# Altium project SoilMonitor.PrjPcb
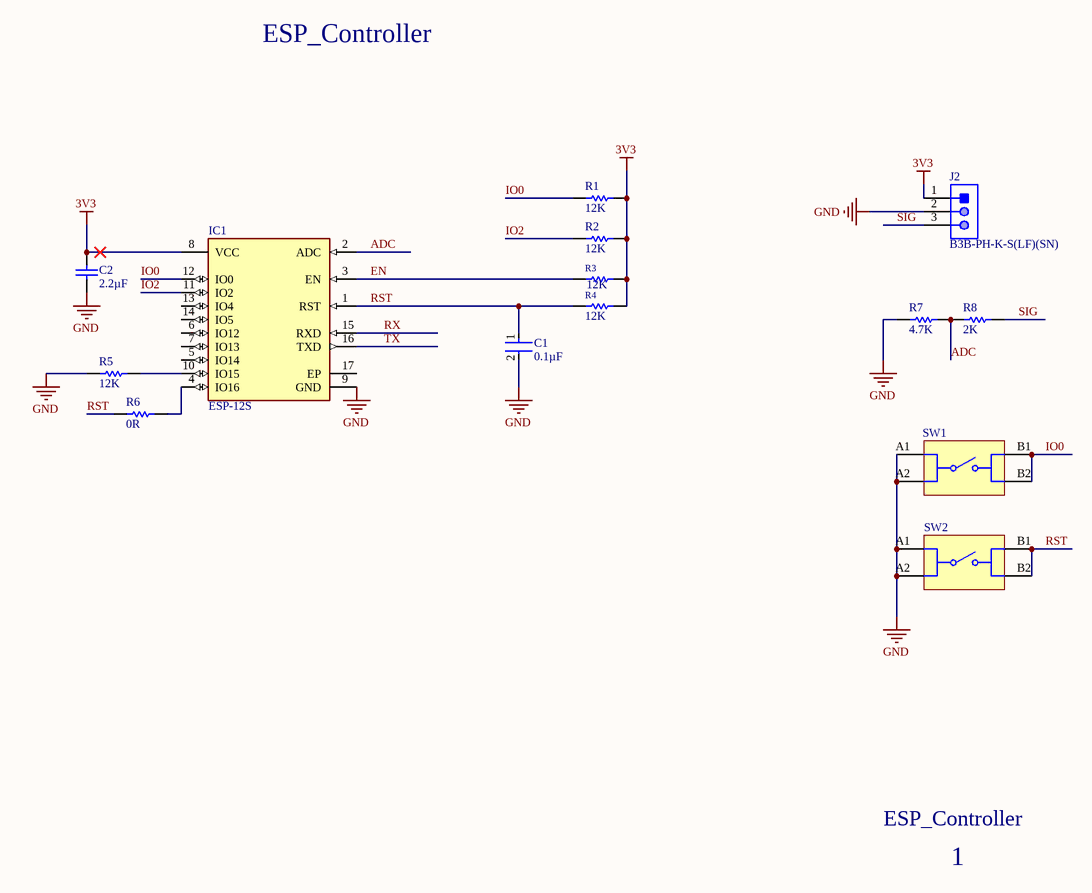
[diagram p0: ESP_Controller.SchDoc]
4 sheets, 38 parts. Net scope: global (net labels, ports and power ports of the same name join across sheets).
Board file: SoilMonitor.PcbDoc
Sheets:
  ESP_Controller.SchDoc
  USB_Input.SchDoc
  USB_to_UART.SchDoc
  Battery_Charging.SchDoc

## Sheet ESP_Controller.SchDoc
size A4; SheetNumber: 1; SheetTotal: 4; SPICEModelCacheITBBTXQH: <root> / <DocumentId>ITBBTXQH</DocumentId> / </root>

### Parts
C1  0.1µF  [FP-CC0603-DA-MFG]
C2  2.2µF  [CAPC2013X145X50ML20T25]
IC1  ESP-12S  [FP-ESP-12S-MFG]
J2  B3B-PH-K-S(LF)(SN)  [JST-B3B-PH-K-S-3_V]
R1  12K  [RESC2013X70X40ML20T20]
R2  12K  [RESC2013X70X40ML20T20]
R3  12K  [RESC2013X70X40ML20T20]
R4  12K  [RESC2013X70X40ML20T20]
R5  12K  [RESC2013X70X40ML20T20]
R6  0R  [RESC2013X70X40NL20T20]
R7  4.7K  [RESC2013X60X40ML20T25]
R8  2K  [RESC2013X60X40ML20T25]
SW1  430773051825  [430773051825]  (value not drawn)
SW2  430773051825  [430773051825]  (value not drawn)

### Nets
3V3: C2.2 IC1.8(VCC) J2.1 R1.2 R2.2 R3.2 R4.2
GND: C1.2 C2.1 IC1.9(GND) J2.2 R5.1 R7.1 SW1.A1 SW1.A2 SW2.A1 SW2.A2
ADC: IC1.2(ADC) R7.2 R8.1
EN: IC1.3(EN) R3.1
IO0: IC1.12(IO0) R1.1 SW1.B1 SW1.B2
IO2: IC1.11(IO2) R2.1
RST: C1.1 IC1.1(RST) R4.1 R6.1 SW2.B1 SW2.B2
RX: IC1.15(RXD)
SIG: J2.3 R8.2
TX: IC1.16(TXD)
NetIC1_4: IC1.4(IO16) R6.2
NetIC1_10: IC1.10(IO15) R5.2

Not connected (* = marked no-connect by the designer): IC1 5(IO14) 6(IO12) 7(IO13) 13(IO4) 14(IO5) 17(EP)

### Notes on the sheet
- ESP_Controller
- 1

### Library data of the parts
C1 = CMP-03422-001463-1: Capacitor Ceramic 0.1uF 6.3V X7R 10% 0603 Paper T/R; RoHS Compliant: Yes
C2 = CMP-1036-04819-2: Part Number: C0805C225K9PACTU; Manufacturer: Kemet
IC1 = CMP-204316-000002-1: RX TXRX MOD WIFI PCB TRACE SMD; Interface: I2C; Sensitivity: -90dBm; Data Rate: 54Mbps; Frequency: 2.484GHz; Series: -
J2 = CMP-2000-05164-1: Male Header, Pitch 2 mm, 1 x 3 Position, Height 6 mm, Tail Length 3.4 mm, -25 to 85 degC, RoHS, Bulk; Manufacturer: JST; Style/Orientation: StraightHeader/Plug; Pitch: 2mm; No of Positions: 3; Termination: Crimp; Manufacturer URL: http://www.jst.com/home2.html; Datasheet Version: Oct-06; Type: ShroudedHeader; Datasheet URL: https://datasheet.ciiva.com/11746/0900766b80826550-11746939.pdf
R1-R5 = CMP-2001-00347-1: Part Number: ERJ-6GEYJ123V; Manufacturer: Panasonic
R6 = CMP-1665-00002-5: Chip Resistor, 0 Ohm, +/- 1%, 0.125 W, -55 to 155 degC, 0805 (2012 Metric), RoHS, Tape and Reel; PartNumber: ERJ-6GEY0R00V; Tolerance: 5%; Resistance: 0 Ohm; REACH SVHC: No SVHC; Min Operating Temperature: -55 degC; Case/Package: 0805; Packaging: Tape and Reel; Package Quantity: 5000; ComponentLink1Description: Manufacturer URL; PackageDescription: 2-Pin Surface Mount Device, Body 2 x 1.25 mm; Mounting Technology: Surface Mount; Max Operating Temperature: 155 degC; Width: 1.25 mm; RoHSCompliant: True; Height: 0.6 mm; ComponentLink1URL: http://www.panasonic.com/; ComponentLink2URL: http://industrial.panasonic.com/cdbs/www-data/pdf/RDA0000/AOA0000C84.pdf; Case Code (Imperial): 0805; DatasheetVersion: 03/2015; Length: 2 mm; Case Code (Metric): 2012; ComponentLink2Description: Datasheet; Radiation Hardening: No
R7 = CMP-2001-00644-1: Part Number: ERA6AEB472V; Manufacturer: Panasonic
R8 = CMP-2001-00609-1: Part Number: ERA6AEB202V; Manufacturer: Panasonic
SW1 SW2 = CMP-03913-86984039-2: Tactile Switch, 0.05A, 12Vdc, 250Gf, Smd Rohs Compliant: Yes; Voltage Rating: 12V; Contact Resistance: 100mΩ; Contact Current Rating: 50mA; Life (Cycles): 500kcycles; Packaging: Tape and Reel; Insulation Resistance: 100MΩ; RoHS: Compliant; Min Operating Temperature: -40°C; Height: 5.1mm; Max Operating Temperature: 85°C; Mount: Surface Mount; Contact Plating: Silver; Current Rating: 50mA; Voltage Rating (DC): 12V

## Sheet USB_Input.SchDoc
size A4; SheetNumber: 2; SheetTotal: 4
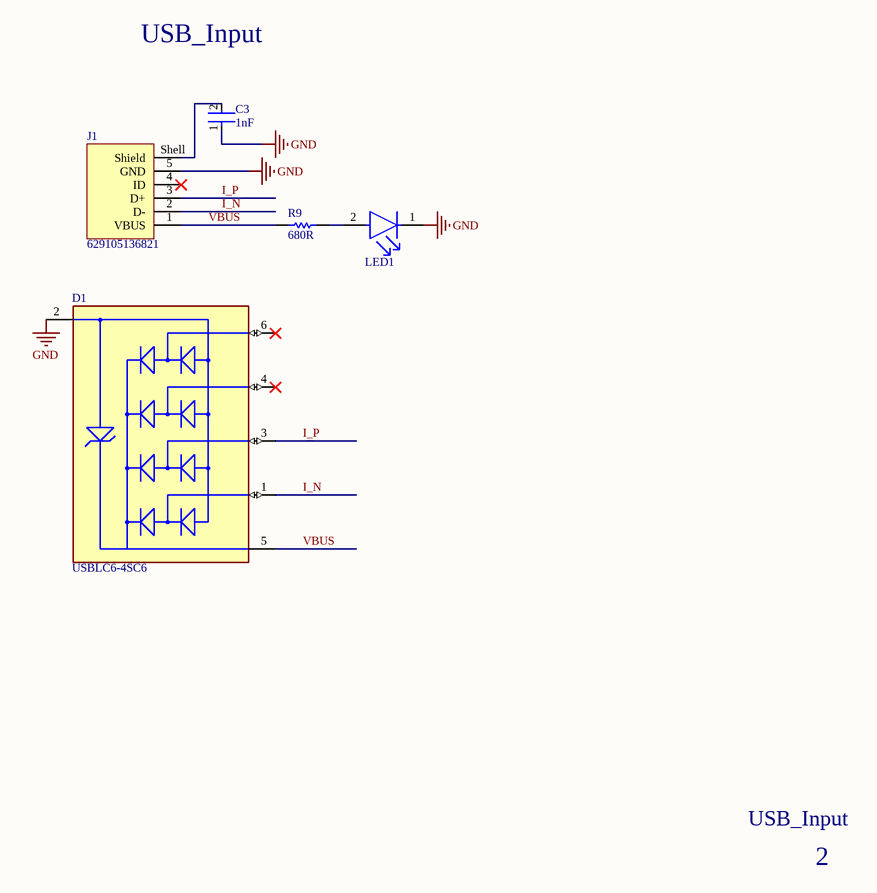
[diagram p1: USB_Input.SchDoc]

### Parts
C3  1nF  [FP-CC0603-DA-MFG]
D1  USBLC6-4SC6  [FP-SOT23-6L-MFG]
J1  629105136821  [629105136821]
LED1  LS R976-NR-1  [FP-LS_R976-MFG]  (value not drawn)
R9  680R  [RESC1608X55X30ML20T20]

### Nets
GND: C3.1 D1.2(GND) J1.5(GND) LED1.1(C)
I_N: D1.1(I/O1) J1.2(D-)
I_P: D1.3(I/O2) J1.3(D+)
VBUS: D1.5(VBUS) J1.1(VBUS) R9.2
NetC3_2: C3.2 J1.Shell(Shield)
NetLED1_2: LED1.2(A) R9.1

Not connected (* = marked no-connect by the designer): D1 4(I/O3)* 6(I/O4)*; J1 4(ID)*

### Notes on the sheet
- USB_Input
- 2

### Library data of the parts
C3 = CMP-2100-03599-2: CAP CER 1000PF 50V X7R 0603; Manufacturer Part Number: CC0603KRX7R9BB102; Manufacturer: YAGEO; Material: Ceramic; Capacitance: 1.0 nF; Tolerance: 0.1; Value: 1.0 nF; Temperature Coefficient: 15%; Device Class L3: Ceramic Capacitors; Automotive: No; Digikey Description: CAP CER 1000PF 50V X7R 0603; Lead Free: Yes; Temperature Range High: +125°C; ComponentLink2URL: http://www.yageo.com/documents/recent/UPY-GPHC_X7R_6.3V-to-50V_18.pdf; Category: Cap; Footprint Url: http://www.yageo.com/exep/pages/download/literatures/UPY-C_GEN_24.pdf; RoHS: TRUE; Octopart: https://octopart.com/cc0603krx7r9bb102-yageo-192933; ComponentLink2Description: Datasheet; Device Class L2: Capacitors; Mouser Description: Multilayer Ceramic Capacitors MLCC - SMD/SMT 1.0nF 50V X7R 10%; Temperature Range Low: -55°C; Temperature Characteristic: X7R; Device Class L1: Passive Components; Temperature: -55°C to +125°C; Package: CC0603-DA; Voltage: 50 V; Voltage Rating: 50 V; Height: 0.9mm
D1 = CMP-2000-07370-2: TVS DIODE 5.25V 17V SOT23-6; Manufacturer: STMicroelectronics; Peak Pulse Power: 130W; Breakdown Voltage: 6V; Value: 3pF; Direction: Unidirectional; Interface: USB,Ethernet,Other; Number Of Channels: 4; Standoff Height: 0mm; Max Junction Temp: +125°C; Digikey Description: TVS DIODE 5.25V 17V SOT23-6; Automotive: No; Package: SOT23-6L; Mouser Description: USBLC6 Series 4 Line 6 V Uni / Bi-Directional ESD Protection - SOT-23-6; Octopart: https://octopart.com/usblc6-4sc6-stmicroelectronics-347147; RoHS: TRUE; ComponentLink2URL: https://upverter.com/datasheet/23dc4ffb028d868909e80577610284b194f13213.pdf; ComponentLink2Description: Datasheet; Device Class L1: Circuit Protection; Lead Free: Yes; Temperature Range High: +125°C; Device Class L2: ESD and Circuit Protection ICs; Device Class L3: unset; Capacitance: 3pF; Height: 1.45mm; Temperature Range Low: -40°C; Manufacturer Part Number: USBLC6-4SC6; Temperature: -40°C to +125°C; Category: Diode; Clamping Voltage: 17V
J1 = CMP-1502-03253-2: NexarPartId: 19991173; Insulation Resistance: 1GΩ; Contact Resistance: 30mΩ; Number of Contacts: 5; Number of Ports: 1; Gender: Receptacle; Current Rating: 1A; Connector Type: USB; Voltage Rating: 30V; USB Standard: USB 2.0; Plating: Nickel; Max Operating Temperature: 105°C; Orientation: Horizontal; Height: 2.9mm; Termination: Solder; Min Operating Temperature: -40°C; Number of Pins: 5; Flammability Rating: UL94 V-0; Lead Free: Lead Free; Packaging: Tape and Reel; Contact Plating: Gold; RoHS: Compliant; Mount: Horizontal, Surface Mount; Color: Black; REACH SVHC: Unknown; Operating Supply Voltage: 30V; Contact Material: Copper; Number of Positions: 5; Length: 5.9mm
LED1 = CMP-62016-000037-1: LED RED DIFFUSED 0805 SMD; Lens Size: 1.25mm; Number of LEDs: 1; Luminous Intensity: 180mcd; Dominant Wavelength: 633nm; Lens Style: Flat; Reverse Voltage: 12V; Lens Color: White; Forward Voltage: 2.5V; Forward Current: 25mA; Power Dissipation: 65W; Luminous Flux: 0.47lm; Test Current: 20mA; Viewing Angle: 160°; Length: 2mm; Number of Pins: 2; Lens Transparency: Diffused; Min Operating Temperature: -30°C; Case Code (Metric): 2012; Depth: 1.35mm; Color: Red; Illumination Color: Red; Max Operating Temperature: 85°C; Mount: Surface Mount; Case/Package: 0805; Height: 0.9mm; Package Quantity: 16000; Number of Elements: 1; Radiation Hardening: No; Case Code (Imperial): 0805; Packaging: Tape and Reel; Width: 1.25mm
R9 = CMP-2000-00114-1: Manufacturer: Panasonic; Part Number: ERA-3AEB681V

## Sheet USB_to_UART.SchDoc
size A4; SheetNumber: 3; SheetTotal: 4
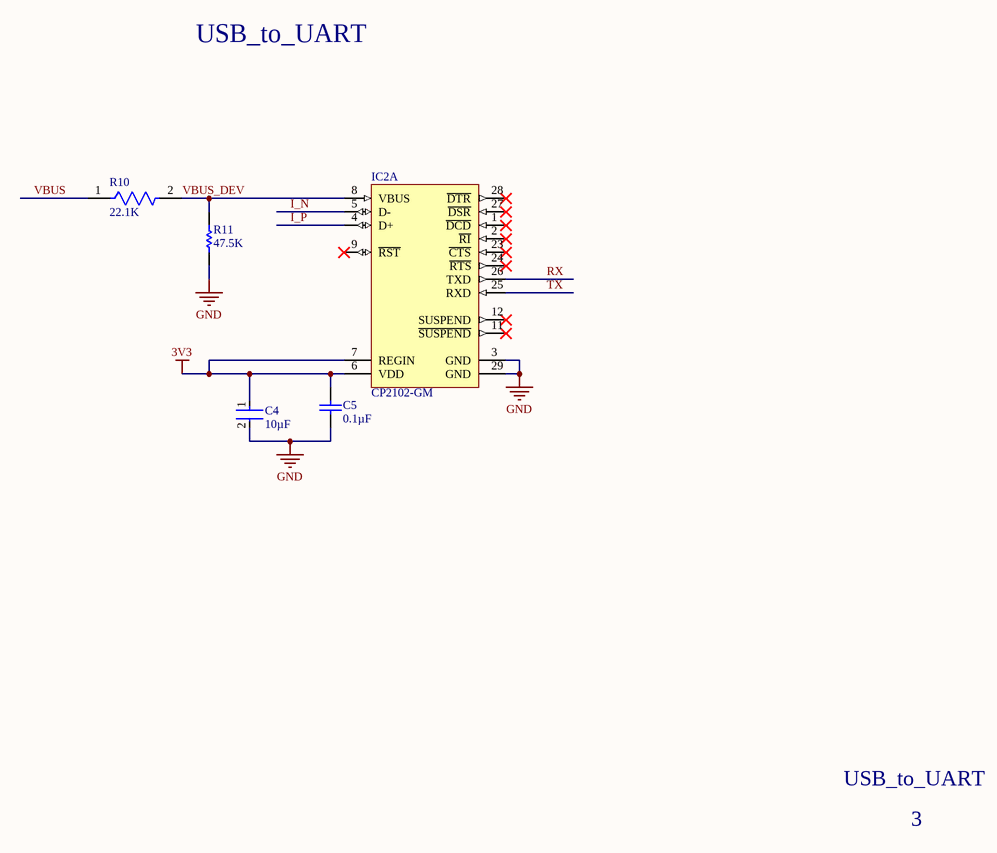
[diagram p2: USB_to_UART.SchDoc]

### Parts
C4  10µF  [FP-CC0603-0_15-0_95-IPC_B]
C5  0.1µF  [CAPC1608X87X35NL15T15]
IC2  CP2102-GM  [SLAB-QFN-28-3125x3125TP_N]  (part A of 2)
R10  22.1K  [FP-RC0603-0_55-MFG]
R11  47.5K  [RESC1608X55X30LL15T15]

### Nets
3V3: C4.1 C5.2 IC2.6(VDD) IC2.7(REGIN)
GND: C4.2 C5.1 IC2.3(GND) IC2.29(GND) R11.1
I_N: IC2.5(D-)
I_P: IC2.4(D+)
RX: IC2.26(TXD)
TX: IC2.25(RXD)
VBUS: R10.1
VBUS_DEV: IC2.8(VBUS) R10.2 R11.2

Not connected (* = marked no-connect by the designer): IC2 1(~{DCD})* 2(~{RI})* 9(~{RST})* 11(~{SUSPEND})* 12(SUSPEND)* 23(~{CTS})* 24(~{RTS})* 27(~{DSR})* 28(~{DTR})*

### Notes on the sheet
- USB_to_UART
- 3

### Library data of the parts
C4 = CMP-03422-001506-1: CAP CER 10UF 6.3V X5R 0603; Tolerance: 20%; Voltage: 4V; Depth: 0.8mm; Halogen Free: Halogen Free; Case Code (Metric): 1608; Height: 0.8mm; Voltage Rating (DC): 6.3V; Construction: Flat; Series: CC; Lead Free: Lead Free; Min Operating Temperature: -55°C; Capacitance: 10uF; Thickness: 0.035inch; Max Operating Temperature: 85°C; Termination: SMD/SMT; Length: 1.6mm; Resistor Type: Ceramic; Dielectric: X5R; Mount: Surface Mount; Width: 0.031inch; Case/Package: 0603; Packaging: Tape and Reel; Case Code (Imperial): 0603; Voltage Rating: 6.3V; Weight: 7.1E-05oz; Radiation Hardening: No; RoHS Compliant: Yes
C5 = CMP-1035-02576-2: Part Number: C0603C104K9RACTU; Manufacturer: Kemet
IC2 = CMP-0511-00012-1: Single-Chip USB to UART Bridge, 1024 Bytes EEPROM, -40 to 85 degC, 28-pin QFN, Tube; Manufacturer: Silicon Labs; Internal Oscillator: TRUE; Sub-Family: USB Bridges; ComponentLink3Description: Package Specification; PackageDescription: 28-Pin Quad-Flat No-Leads Package, Body 5 x 5 mm, Pitch 0.5 mm; PartNumber: CP2102-GM; EEPROM: 1024 Bytes; Mounting Technology: Surface Mount; ComponentLink2URL: http://www.silabs.com/Support%20Documents/TechnicalDocs/CP2102-9.pdf; DatasheetVersion: Rev. 1.5; ComponentLink1URL: http://www.silabs.com/; ComponentLink2Description: Datasheet; Code_JEDEC: MO-220; PackageReference: QFN-28; Code_IPC: J-STD-020C; ComponentLink3URL: http://www.silabs.com/Support%20Documents/TechnicalDocs/C8051T61x.pdf; ComponentLink1Description: Manufacturer URL
R10 = CMP-03412-037792-1: RES SMD 22.1K OHM 1% 1/10W 0603; Voltage Rating: 50V; Power Rating: 100mW; Temperature Coefficient: 100ppm/°C; Resistance: 22.1kR; Width: 0.8mm; Packaging: Tape and Reel; Series: RC; Size Code: 0603; Case Code (Imperial): 0603; Package Quantity: 5000; Min Operating Temperature: -55°C; Tolerance: 1%; Voltage Rating (DC): 50V; Lead Free: Lead Free; Case Code (Metric): 1608; Termination: SMD/SMT; Height: 0.45mm; Case/Package: 0603; Length: 1.6mm; Max Operating Temperature: 155°C
R11 = CMP-2000-00527-1: Manufacturer: Panasonic; Part Number: ERJ-3EKF4752V

## Sheet Battery_Charging.SchDoc
size A4; SheetNumber: 4; SheetTotal: 4
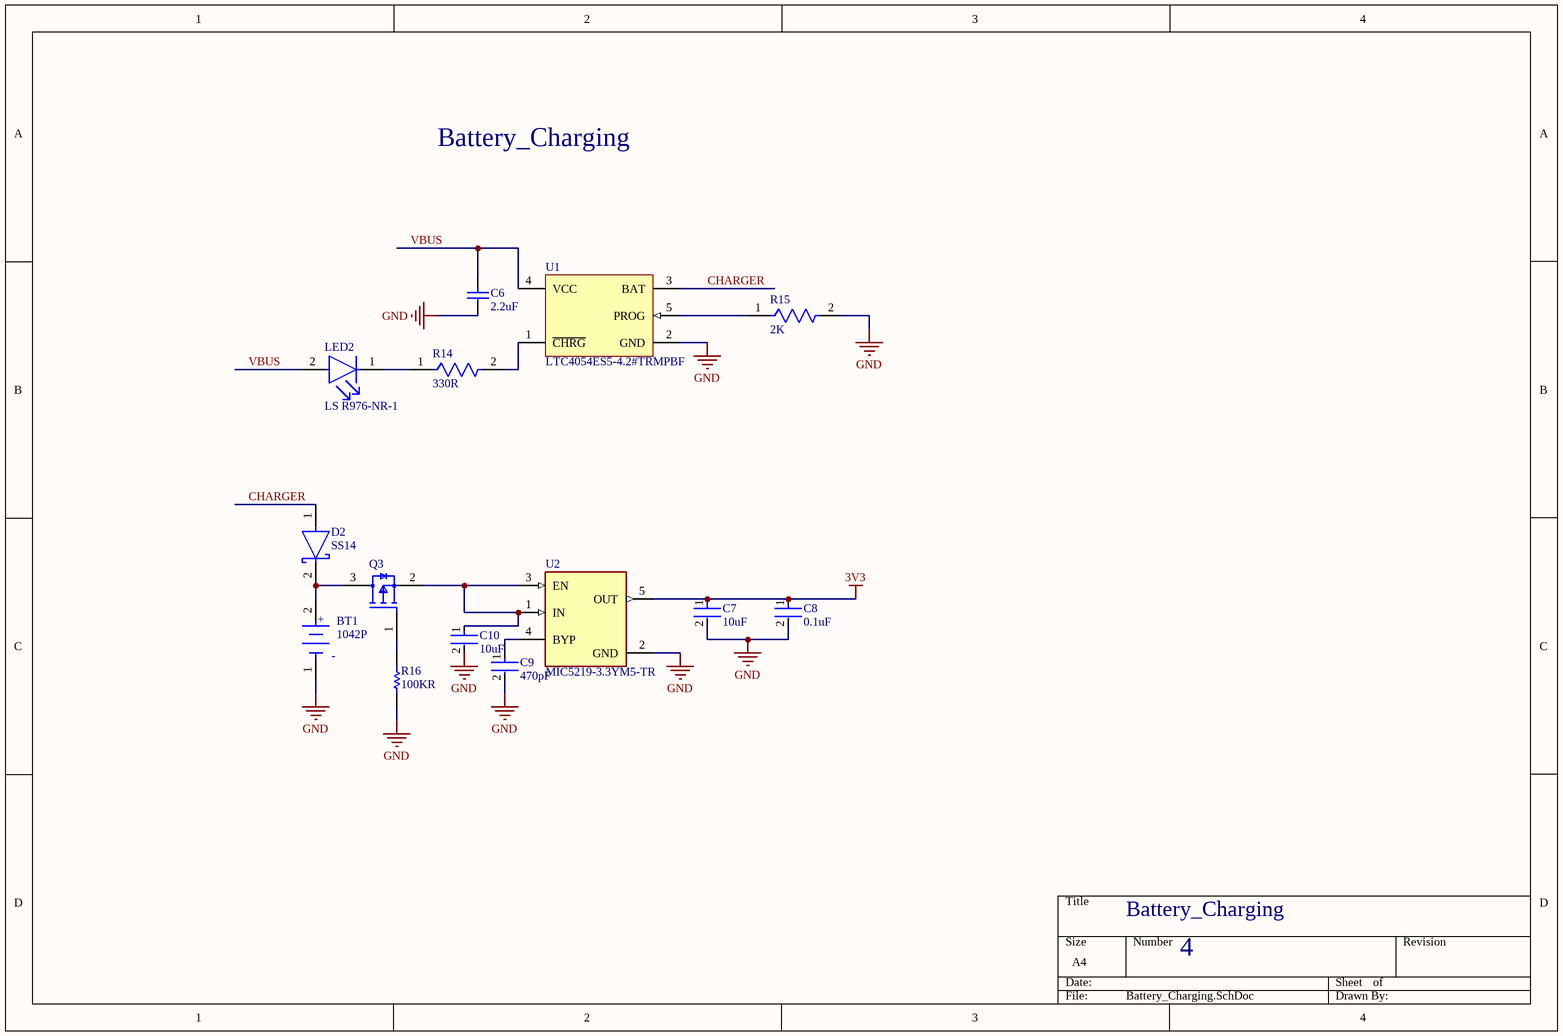
[diagram p3: Battery_Charging.SchDoc]

### Parts
BT1  1042P  [FP-1042P-MFG]
C6  2.2uF  [CAPC2013X145X50ML20T25]
C7  10uF  [FP-CL21-IPC_C]
C8  0.1uF  [FP-CC0805-EA-MFG]
C9  470pF  [FP-C0603C-CF-MFG]
C10  10uF  [FP-CL21-IPC_A]
D2  SS14  [FP-403AE-MFG]
LED2  LS R976-NR-1  [FP-LS_R976-MFG]
Q3  SI2301BDS-T1-GE3  [FP-S-03946-MFG]  (value not drawn)
R14  330R  [FP-CPF0603-MFG]
R15  2K  [FP-RMCF0603-IPC_A]
R16  100KR  [RESC2013X70X40ML20T20]
U1  LTC4054ES5-4.2#TRMPBF  [LT-S5-5-TSOT-23_M]
U2  MIC5219-3.3YM5-TR  [FP-SOT23-5LD-PL-1-IPC_C]

### Nets
3V3: C7.1 C8.1 U2.5(OUT)
GND: BT1.1(C) C6.1 C7.2 C8.2 C9.2 C10.2 R15.2 R16.2 U1.2(GND) U2.2(GND)
CHARGER: D2.1(A) U1.3(BAT)
VBUS: C6.2 LED2.2(A) U1.4(VCC)
NetBT1_2: BT1.2(A) D2.2(C) Q3.3(D)
NetC9_1: C9.1 U2.4(BYP)
NetC10_1: C10.1 Q3.2(S) U2.1(IN) U2.3(EN)
NetLED2_1: LED2.1(C) R14.1
NetQ3_1: Q3.1(G) R16.1
NetR14_2: R14.2 U1.1(~{CHRG})
NetR15_1: R15.1 U1.5(PROG)

### Notes on the sheet
- Battery_Charging
- 4
- (in symbol CMP-19636-000019-1) +; -

### Library data of the parts
BT1 = CMP-19636-000019-1: BATTERY HOLDER 18650 SMD TAB; Number of Cells: 1; Max Operating Temperature: 145°C; Termination: SMD/SMT; Mount: Surface Mount; Min Operating Temperature: -50°C; Package Quantity: 200; Packaging: Tray; Lead Free: Lead Free
C6 = CMP-1036-04819-2: as C2 on sheet ESP_Controller
C7 = CMP-13271-000175-1: CL21 Series 0805 10uF 6.3V ±10% Tolerance X6S Multilayer Ceramic Chip Capacitor; Depth: 1.25mm; Mount: Surface Mount; Packaging: Tape and Reel; Radiation Hardening: No; Height: 1.25mm; Tolerance: 10%; Package Quantity: 1; Max Operating Temperature: 105°C; Voltage Rating (DC): 6.3V; Case Code (Metric): 2012; Width: 0.049inch; Case/Package: 0805; Voltage Rating: 6.3V; Min Operating Temperature: -55°C; Length: 2mm; Capacitance: 10uF; Lead Free: Lead Free; Thickness: 0.055inch; Case Code (Imperial): 0805; Dielectric: X6S
C8 = CMP-03422-000810-2: CAP CER X7R 0805; RoHS Compliant: Yes
C9 = CMP-03020-003327-1: CAP CER 470PF 10V X7R 0603; Manufacturer: KEMET; Manufacturer Part Number: C0603C471K8RACTU; Temperature Coefficient: 30ppm/°C; Tolerance: 0.1; Automotive Grade: Grade 1; Material: Ceramic; Mouser Description: Capacitor, Ceramic, 470Pf, 10Vdc, 10-% Tol, 10+% Tol, X7r-Tc Code, -15, 15%-Tc Rohs Compliant: Yes; Temperature Range Low: -55°C; Octopart: https://octopart.com/c0603c471k8ractu-kemet-9138956; Temperature Characteristic: X7R; ComponentLink2Description: Datasheet; Device Class L2: Capacitors; RoHS: TRUE; ComponentLink2URL: https://api.kemet.com/component-edge/download/datasheet/C0603C100J5GACAUTO.pdf; Capacitance: 470 pF; Automotive: Yes; Device Class L1: Passive Components; Temperature: -55°C to +125°C; Package: C0603C-CF; Lead Free: Yes; Height: 0.87mm; Device Class L3: Ceramic Capacitors; Digikey Description: CAP CER 470PF 10V X7R 0603; Category: Cap; Value: 470 pF; Voltage Rating: 10 V; Temperature Range High: +125°C
C10 = CMP-13271-001826-1: CL21 Series 0805 10uF 6.3V ±10% Tolerance X5R Multilayer Ceramic Chip Capacitor; Voltage Rating (DC): 6.3V; Thickness: 0.053inch; Min Operating Temperature: -55°C; Mount: Surface Mount; Max Operating Temperature: 85°C; Case Code (Metric): 2012; Dielectric: X5R; Length: 2mm; Case Code (Imperial): 0805; Radiation Hardening: No; Height: 1.25mm; Depth: 1.25mm; Contact Plating: Tin; Voltage Rating: 6.3V; Width: 0.049inch; Package Quantity: 1; Capacitance: 10uF; Packaging: Tape and Reel; Tolerance: 10%; Lead Free: Lead Free; Case/Package: 0805
D2 = CMP-2000-04943-2: DIODE SCHOTTKY 40V 1A SMA; Manufacturer: ON Semiconductor; Peak Reverse Current: 0.2mA; Max Junction Temp: +125°C; Standoff Height: 0.05mm; Max Surge Forward Current: 40A; Mouser Description: Schottky Diodes & Rectifiers SMA 40V 1.0A; RoHS: TRUE; Lead Free: Yes; Manufacturer Part Number: SS14; Device Class L3: Schottky Diodes; Category: Diode; Automotive: No; Digikey Description: DIODE SCHOTTKY 40V 1A SMA; ComponentLink2Description: Datasheet; Device Class L2: Diodes; Height: 2.5mm; Temperature Range High: +125°C; ComponentLink2URL: https://www.onsemi.com/pub/Collateral/SS19-D.PDF; Device Class L1: Discrete Semiconductors; Package: 403AE; Octopart: https://octopart.com/ss14-on+semiconductor-29205033; Max Repetitive Reverse Voltage: 40V; Temperature Range Low: -65°C; Forward Current: 1A; Temperature: -65°C to +125°C
LED2 = CMP-62016-000037-1: as LED1 on sheet USB_Input; Length: 2mm; Number of Pins: 2; Lens Transparency: Diffused; Min Operating Temperature: -30°C; Case Code (Metric): 2012; Depth: 1.35mm; Color: Red; Illumination Color: Red; Max Operating Temperature: 85°C; Mount: Surface Mount; Case/Package: 0805; Height: 0.9mm; Package Quantity: 16000; Number of Elements: 1; Radiation Hardening: No; Case Code (Imperial): 0805; Packaging: Tape and Reel; Width: 1.25mm
Q3 = CMP-00030-42864886-1: SI2301BDS-T1-GE3 Trans Mosfet P-ch Si 20V 2.2A 3-PIN SOT-23 T/r / Mosfet P-ch 20V 2.2A SOT23-3; Rise Time: 40ns; Nominal Vgs: -950mV; Gate to Source Voltage (Vgs): 8V; Element Configuration: Single; Number of Channels: 1; Power Dissipation: 700mW; Resistance: 100MΩ; Continuous Drain Current (ID): -2.2A; Drain to Source Breakdown Voltage: -20V; Turn-On Delay Time: 20ns; Turn-Off Delay Time: 30ns; Input Capacitance: 375pF; Schedule B: 8541210080, 8541210080; Length: 3.04mm; Height: 1.02mm; Radiation Hardening: No; RoHS: Compliant; NexarPartId: 42864886; Number of Pins: 3; Weight: 1.437803g; Mount: Surface Mount; Min Operating Temperature: -55°C; Number of Elements: 1; Drain to Source Resistance: 100mΩ; Max Power Dissipation: 700mW; Threshold Voltage: -950mV; Lead Free: Lead Free; Rds On Max: 100mΩ; Width: 1.4mm; REACH SVHC: Unknown; Fall Time: 40ns; Max Operating Temperature: 150°C; Drain to Source Voltage (Vdss): -20V; Case/Package: SOT-23-3
R14 = CMP-03211-000699-1: RES SMD 330Ω 0.1% 1/16W 0603; Manufacturer: TE Connectivity; Manufacturer Part Number: CPF0603B330RE1; Voltage Rating: 50V; Temperature Coefficient: 25ppm/°C; Power Rating: 0.063W; Package: CPF0603; Ipc Land Pattern Name: RESC15580X45; Temperature: -55°C to +155°C; Value: 330Ω; Composition: Thin Film; Device Class L3: Chip SMD Resistors; Temperature Range High: +155°C; Resistance: 330Ω; Automotive: No; ComponentLink2URL: https://www.te.com/commerce/DocumentDelivery/DDEController?Action=showdoc&DocId=Data+Sheet%7F1773200%7FM%7Fpdf%7FEnglish%7FENG_DS_1773200_M.pdf%7F3-1676481-2; RoHS: TRUE; Series: CPF; Octopart: https://octopart.com/cpf0603b330re1-te+connectivity-9539413; Tolerance: 0.1%; octopart_url: https://octopart.com/cpf0603b330re1-te+connectivity-9539413; packaging: 1k Reel; Category: Res; Device Class L2: Resistors; Temperature Range Low: -55°C; ComponentLink2Description: Datasheet; Lead Free: Yes; Height: 0.55mm; Device Class L1: Passive Components
R15 = CMP-26527-006357-1: 2kΩ ±1% 0.1W 0603 Thick Film Chip Resistor AEC-Q200 compliant; Temperature Coefficient: 100ppm/°C; Max Power Dissipation: 100mW; Resistance: 2kR; Working Voltage: 75V; Resistor Type: Thick Film; Max Operating Temperature: 155°C; Depth: 0.8mm; Technology: THICK FILM; Case/Package: 0603; Tolerance: 1%; Packaging: Tape and Reel; Contact Plating: Tin; Case Code (Imperial): 0603; Radiation Hardening: No; Mount: Surface Mount; Features: Automotive AEC-Q200; RoHS Compliant: Yes; Military Standard: Not; Number of Terminations: 2; Height: 0.022inch; Width: 0.031inch; Series: RMCF; Lead Free: Lead Free; Length: 1.55mm; Min Operating Temperature: -55°C; Case Code (Metric): 1608; Construction: Rectangular; Power Rating: 100mW
R16 = CMP-2001-04377-1: Part Number: ERJ-6ENF1003V; Manufacturer: Panasonic
U1 = CMP-0471-00454-1: Standalone Linear Li-Ion Battery Charger with Thermal Regulation, 4.25 to 6.5 V Vin, 5-pin SOT23 (S5-5), -40 to 85 degC, Pb-Free, Mini Tape and Reel; Manufacturer: Linear Technology; Number of Cells: 1; Float Voltage: 4.2 V; Max Charge Current(A): 0.8; Vin Max(V): 6.5; Battery Chemistry: Li-Ion, Li-Polymer; Charge Termination: C/10; Vin Min(V): 4.25; ComponentLink1Description: Manufacturer URL; PackageReference: S5-5; ComponentLink1URL: http://www.linear.com/; ComponentLink3Description: Package Specification; Mounting Technology: Surface Mount; ComponentLink2URL: http://cds.linear.com/docs/en/datasheet/405442xf.pdf; Code_JEDEC: MO-193; Packing: Mini Tape and Reel; PartNumber: LTC4054ES5-4.2#TRMPBF; RoHS: TRUE; PackageDescription: 5-Pin Plastic TSOT-23, Body 1.63 x 2.90 mm, Pitch 0.95 mm; Type of Charger: Linear; PackageVersion: Jun-10; ComponentLink3URL: http://cds.linear.com/docs/en/packaging/SOT_5_05-08-1635.pdf; ComponentLink2Description: Datasheet
U2 = CMP-06324-000027-1: IC REG LINEAR 3.3V 500MA SOT23-5; Dropout Voltage: 350mV; Output Type: Fixed; Number of Regulators: 1; Max Input Voltage: 12V; Min Input Voltage: 2.5V; Min Operating Temperature: -40°C; Nominal Output Voltage: 3.3V; Output Voltage: 3.3V; Packaging: Cut Tape; Mount: Surface Mount; Number of Pins: 5; Case/Package: SOT-23-5; Lead Free: Lead Free; Max Operating Temperature: 125°C; REACH SVHC: No SVHC; Output Current: 500mA

## Nets that join several sheets
3V3: ESP_Controller (7 pins), USB_to_UART (C4.1 C5.2 IC2.6 IC2.7), Battery_Charging (C7.1 C8.1 U2.5)
GND: ESP_Controller (10 pins), USB_Input (C3.1 D1.2 J1.5 LED1.1), USB_to_UART (5 pins), Battery_Charging (10 pins)
I_N: USB_Input (D1.1 J1.2), USB_to_UART (IC2.5)
I_P: USB_Input (D1.3 J1.3), USB_to_UART (IC2.4)
RX: ESP_Controller (IC1.15), USB_to_UART (IC2.26)
TX: ESP_Controller (IC1.16), USB_to_UART (IC2.25)
VBUS: USB_Input (D1.5 J1.1 R9.2), USB_to_UART (R10.1), Battery_Charging (C6.2 LED2.2 U1.4)